# Altium schematic sheet pca10056_sheet6_connectors.SchDoc: PCA10056 - Connectors
size A3; Revision: 0.9.0; SheetNumber: 6; SheetTotal: 7; Author: RUBR; DrawnBy: RUBR; ProjectNumber: 4440; PCAName: PCA10056; PCBRevision: 0240RUBR; DocumentSize: A3; PCBNumber: 400236; ProjectName: nRF52840-DK
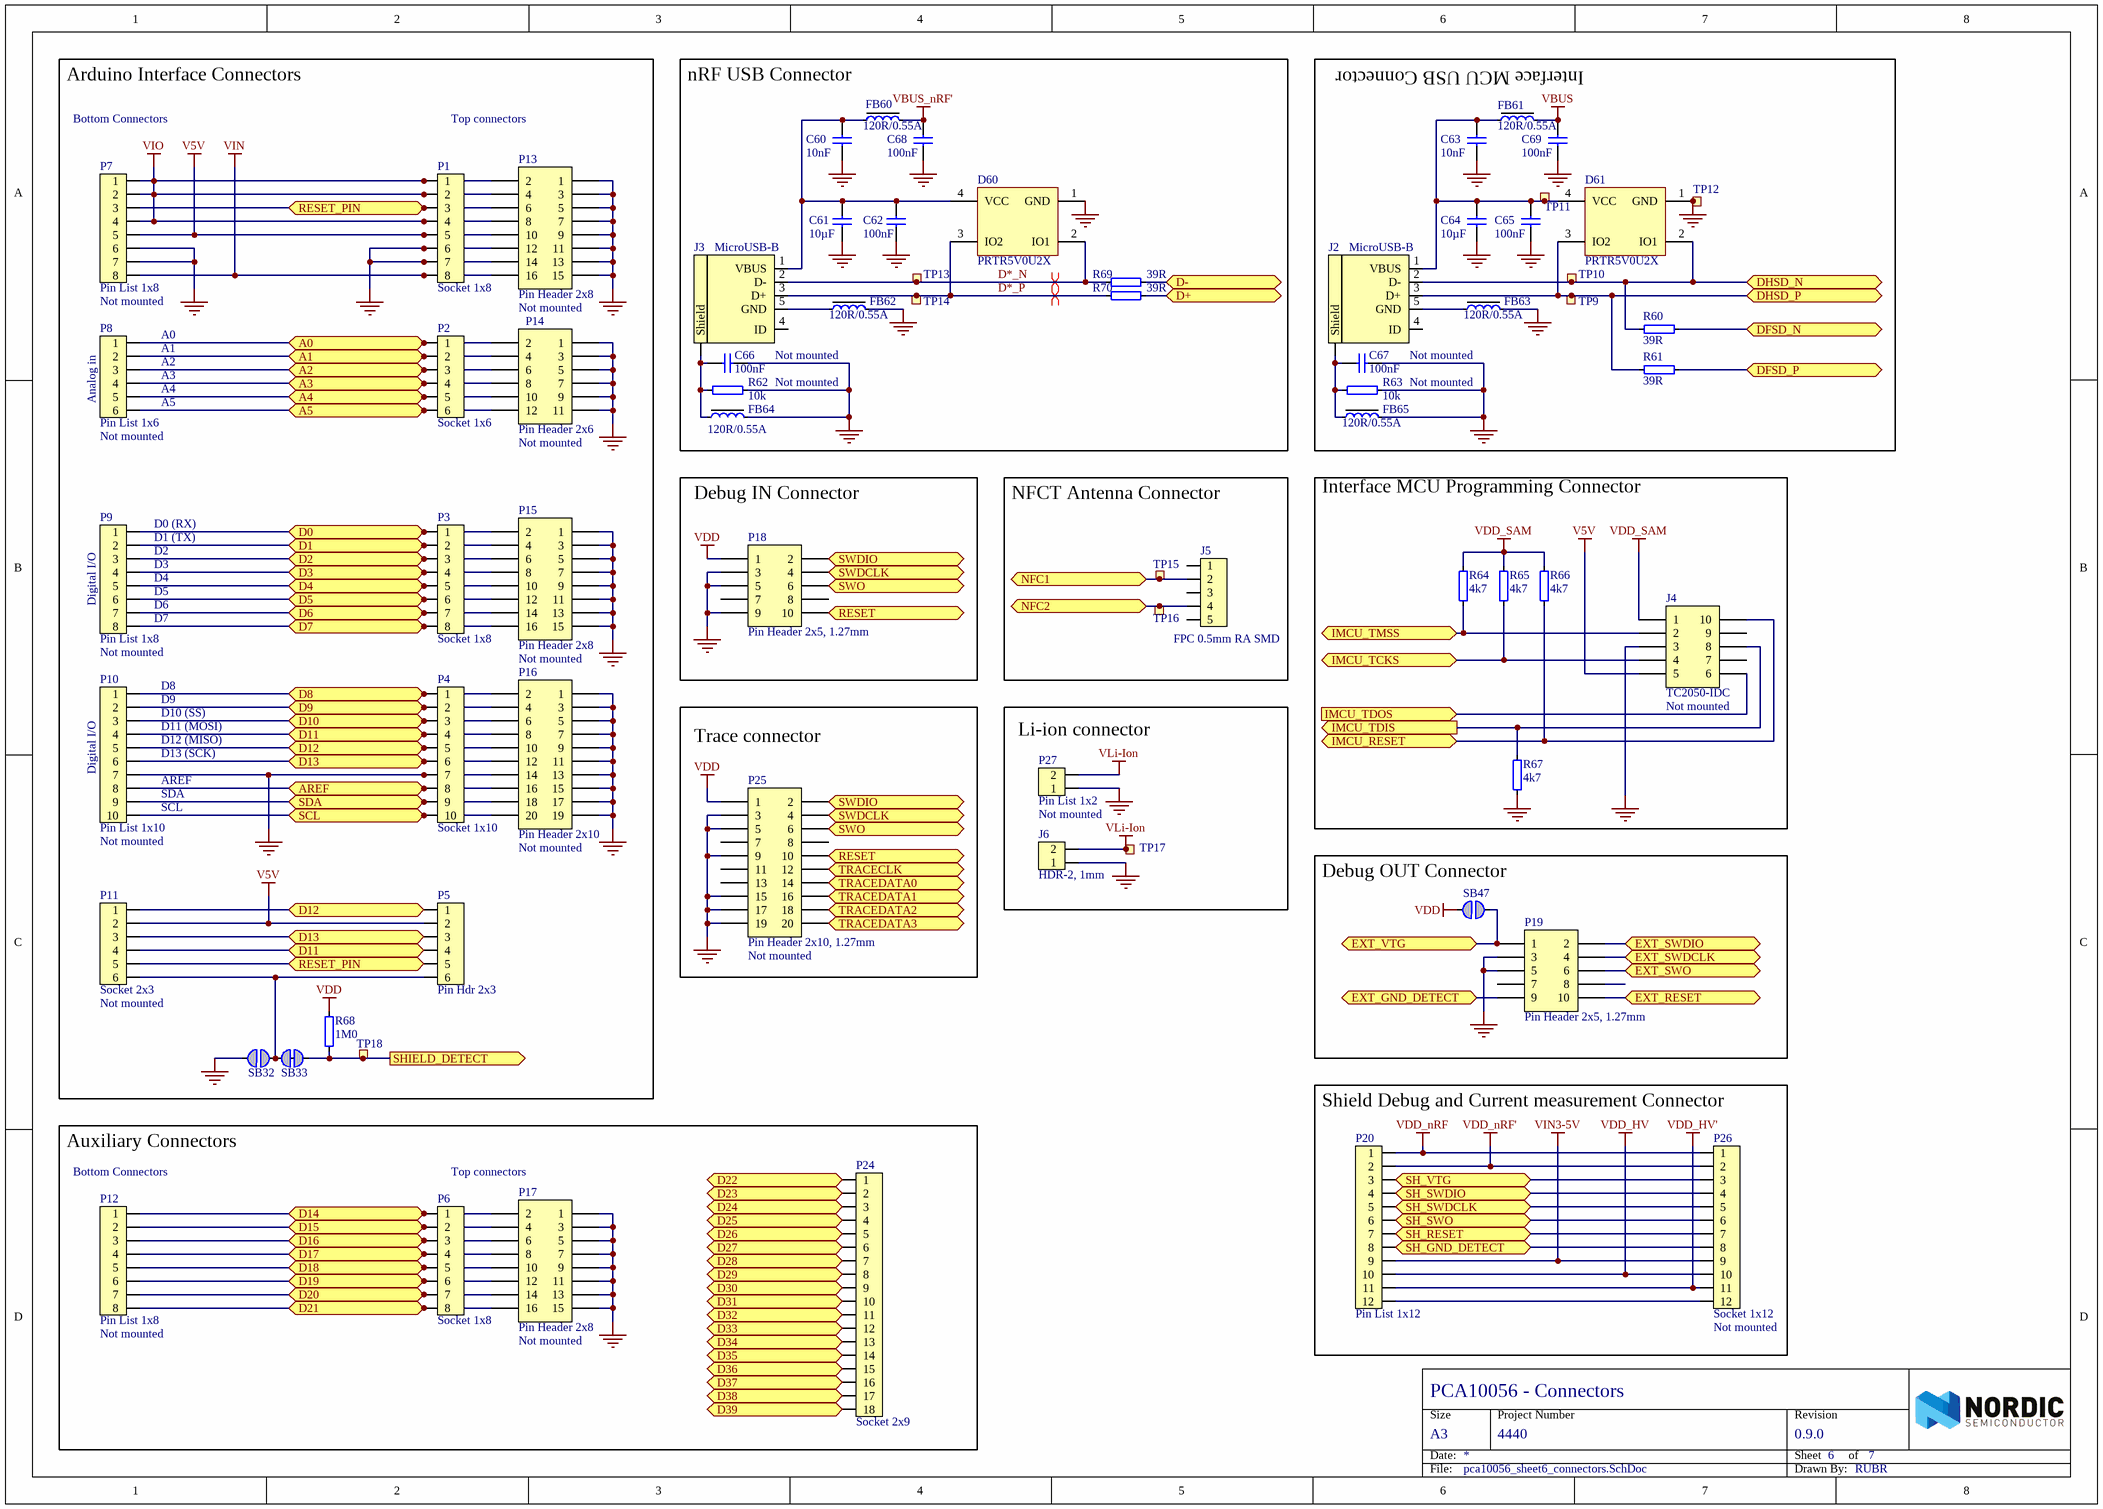
[diagram p0: pca10056_sheet6_connectors.SchDoc]

## Parts
C60  10nF  [CAPC1005X04L]
C61  10µF  [CAPC1608X06L]
C62  100nF  [CAPC1005X04L]
C63  10nF  [CAPC1005X04L]
C64  10µF  [CAPC1608X06L]
C65  100nF  [CAPC1005X04L]
C66  100nF  Assembly: Not mounted  [CAPC1005X04L]
C67  100nF  Assembly: Not mounted  [CAPC1005X04L]
C68  100nF  [CAPC1005X04L]
C69  100nF  [CAPC1005X04L]
D60  PRTR5V0U2X  [SOT190P230X110-4L]
D61  PRTR5V0U2X  [SOT190P230X110-4L]
FB60  120R/0.55A  [INDC1005X04L]
FB61  120R/0.55A  [INDC1005X04L]
FB62  120R/0.55A  [INDC1005X04L]
FB63  120R/0.55A  [INDC1005X04L]
FB64  120R/0.55A  [INDC1005X04L]
FB65  120R/0.55A  [INDC1005X04L]
J2  MicroUSB-B  [USB-Micro-B-RA-SMD-PiP]
J3  MicroUSB-B  [USB-Micro-B-RA-SMD-PiP]
J4  TC2050-IDC  Assembly: Not mounted  [TC2050-IDC-NLFP]
J5  FPC 0.5mm RA SMD  [FPC_05P-0.5mm-RA-SMD]
J6  HDR-2, 1mm  [SM02B-SRSS-TB]
P1  Socket 1x8  [SOCKET_1x8_SMD]
P2  Socket 1x6  [SOCKET_1x6_SMD]
P3  Socket 1x8  [SOCKET_1x8_SMD]
P4  Socket 1x10  [SOCKET_1x10_SMD]
P5  Pin Hdr 2x3  [HDR_2x3-SMD]
P6  Socket 1x8  [SOCKET_1x8_SMD]
P7  Pin List 1x8  Assembly: Not mounted  [LIST_1x8_SMD]
P8  Pin List 1x6  Assembly: Not mounted  [LIST_1x6_SMD]
P9  Pin List 1x8  Assembly: Not mounted  [LIST_1x8_SMD]
P10  Pin List 1x10  Assembly: Not mounted  [LIST_1x10_SMD]
P11  Socket 2x3  Assembly: Not mounted  [SOCKET_2x3_SMD-2.54mm-bottom]
P12  Pin List 1x8  Assembly: Not mounted  [LIST_1x8_SMD]
P13  Pin Header 2x8  Assembly: Not mounted  [HDR_2x8]
P14  Pin Header 2x6  Assembly: Not mounted  [HDR_2x6]
P15  Pin Header 2x8  Assembly: Not mounted  [HDR_2x8]
P16  Pin Header 2x10  Assembly: Not mounted  [HDR_2x10]
P17  Pin Header 2x8  Assembly: Not mounted  [HDR_2x8]
P18  Pin Header 2x5, 1.27mm  [HDR_2x5-SMD-1.27mm-K]
P19  Pin Header 2x5, 1.27mm  [HDR_2x5-SMD-1.27mm-K]
P20  Pin List 1x12  [LIST_1x12_SMD]
P24  Socket 2x9  [SOCKET_2x9_SMD-2.54mm]
P25  Pin Header 2x10, 1.27mm  Assembly: Not mounted  [HDR_2x10-SMD-1.27mm-K]
P26  Socket 1x12  Assembly: Not mounted  [SOCKET_1x12_SMD]
P27  Pin List 1x2  Assembly: Not mounted  [LIST_1x2]
R60  39R  [RESC1005X04L]
R61  39R  [RESC1005X04L]
R62  10k  Assembly: Not mounted  [RESC1005X04L]
R63  10k  Assembly: Not mounted  [RESC1005X04L]
R64  4k7  [RESC1005X04L]
R65  4k7  [RESC1005X04L]
R66  4k7  [RESC1005X04L]
R67  4k7  [RESC1005X04L]
R68  1M0  [RESC1005X04L]
R69  39R  [RESC1005X04L]
R70  39R  [RESC1005X04L]
SB32  Solderbridge  [Solderbridge]  (value not drawn)  (no BOM)
SB33  Solderbridge  [Solderbridge_Shorted]  (value not drawn)  (net tie, no BOM)
SB47  Solderbridge  [Solderbridge]  (value not drawn)  (no BOM)
TP9  Ø1.0mm,SMD  [TP_SMD_Ø1.0mm]  (value not drawn)  (no BOM)
TP10  Ø1.0mm,SMD  [TP_SMD_Ø1.0mm]  (value not drawn)  (no BOM)
TP11  Ø1.0mm,SMD  [TP_SMD_Ø1.0mm]  (value not drawn)  (no BOM)
TP12  Ø1.0mm,SMD  [TP_SMD_Ø1.0mm]  (value not drawn)  (no BOM)
TP13  Ø1.0mm,SMD  [TP_SMD_Ø1.0mm]  (value not drawn)  (no BOM)
TP14  Ø1.0mm,SMD  [TP_SMD_Ø1.0mm]  (value not drawn)  (no BOM)
TP15  Ø1.0mm,SMD  [TP_SMD_Ø1.0mm]  (value not drawn)  (no BOM)
TP16  Ø1.0mm,SMD  [TP_SMD_Ø1.0mm]  (value not drawn)  (no BOM)
TP17  Ø1.0mm,SMD  [TP_SMD_Ø1.0mm]  (value not drawn)  (no BOM)
TP18  Ø1.0mm,SMD  [TP_SMD_Ø1.0mm]  (value not drawn)  (no BOM)

## Blocks framed on the sheet
Arduino Interface Connectors: P1-P5 P7-P11 P13-P16 R68 SB32 SB33 TP18
nRF USB Connector: C60-C62 C66 C68 D60 FB60 FB62 FB64 J3 R62 R69 R70 TP13 TP14
Interface MCU USB Connector: C63-C65 C67 C69 D61 FB61 FB63 FB65 J2 R60 R61 R63 TP9-TP12
Debug IN Connector: P18
NFCT Antenna Connector: J5 TP15 TP16
Interface MCU Programming Connector: J4 R64-R67
Trace connector: P25
Li-ion connector: J6 P27 TP17
Debug OUT Connector: P19 SB47
Shield Debug and Current measurement Connector: P20 P26
Auxiliary Connectors: P6 P12 P17 P24

## Ports
A0 (bidir), A1 (bidir), A2 (bidir), A3 (bidir), A4 (bidir), A5 (bidir), AREF (bidir), D0 (bidir), D1 (bidir), D2 (bidir), D3 (bidir), D4 (bidir), D5 (bidir), D6 (bidir), D7 (bidir), D8 (bidir), D9 (bidir), D10 (bidir), D11 (bidir), D12 (bidir), D13 (bidir), D14 (bidir), D15 (bidir), D16 (bidir), D17 (bidir), D18 (bidir), D19 (bidir), D20 (bidir), D21 (bidir), D22 (bidir), D23 (bidir), D24 (bidir), D25 (bidir), D26 (bidir), D27 (bidir), D28 (bidir), D29 (bidir), D30 (bidir), D31 (bidir), D32 (bidir), D33 (bidir), D34 (bidir), D35 (bidir), D36 (bidir), D37 (bidir), D38 (bidir), D39 (bidir), D+ (bidir), D- (bidir), DFSD_N (bidir), DFSD_P (bidir), DHSD_N (bidir), DHSD_P (bidir), EXT_GND_DETECT (bidir), EXT_RESET (bidir), EXT_SWDCLK (bidir), EXT_SWDIO (bidir), EXT_SWO (bidir), EXT_VTG (bidir), IMCU_RESET (bidir), IMCU_TCKS (bidir), IMCU_TDIS (out), IMCU_TDOS (in), IMCU_TMSS (bidir), NFC1 (bidir), NFC2 (bidir), RESET (bidir), RESET_PIN (bidir), SCL (bidir), SDA (bidir), SH_GND_DETECT (bidir), SH_RESET (bidir), SH_SWDCLK (bidir), SH_SWDIO (bidir), SH_SWO (bidir), SH_VTG (bidir), SHIELD_DETECT (out), SWDCLK (out), SWDIO (bidir), SWO (bidir), TRACECLK (bidir), TRACEDATA0 (bidir), TRACEDATA1 (bidir), TRACEDATA2 (bidir), TRACEDATA3 (bidir)

## Nets
GND: C60.1 C61.1 C62.1 C63.2 C64.1 C65.1 C66.1 C67.1 C68.1 C69.1 D60.1(GND) D61.1(GND) FB62.2 FB63.2 FB64.2 FB65.2 J4.3 J6.1 P1.6 P1.7 P4.7 P7.6 P7.7 P10.7 P13.1 P13.3 P13.5 P13.7 P13.9 P13.11 P13.12 P13.13 P13.14 P13.15 P14.1 P14.3 P14.5 P14.7 P14.9 P14.11 P15.1 P15.3 P15.5 P15.7 P15.9 P15.11 P15.13 P15.15 P16.1 P16.3 P16.5 P16.7 P16.9 P16.11 P16.13 P16.14 P16.15 P16.17 P16.19 P17.1 P17.3 P17.5 P17.7 P17.9 P17.11 P17.13 P17.15 P18.3 P18.5 P18.9 P19.3 P19.5 P25.3 P25.5 P25.9 P25.15 P25.17 P25.19 P27.1 R62.1 R63.1 R67.2 SB32.1 TP12.1
V5V: J4.5 P1.5 P5.2 P7.5 P11.2 P13.10
VBUS: C69.2 FB61.2
VBUS_nRF': C68.2 FB60.2
VDD: P18.1 P25.1 R68.2 SB47.1
VDD_HV: P20.10 P26.10
VDD_HV': P20.11 P26.11
VDD_nRF: P20.1 P26.1
VDD_nRF': P20.2 P26.2
VDD_SAM: J4.1 R64.2 R65.2 R66.2
VIN: P1.8 P7.8 P13.16
VIN3-5V: P20.9 P26.9
VIO: P1.1 P1.2 P1.4 P7.1 P7.2 P7.4 P13.2 P13.4 P13.8
VLi-Ion: J6.2 P27.2 TP17.1
A0: P2.1 P8.1 P14.2 ; port A0
A1: P2.2 P8.2 P14.4 ; port A1
A2: P2.3 P8.3 P14.6 ; port A2
A3: P2.4 P8.4 P14.8 ; port A3
A4: P2.5 P8.5 P14.10 ; port A4
A5: P2.6 P8.6 P14.12 ; port A5
AREF: P4.8 P10.8 P16.16 ; port AREF
D0: P3.1 P9.1 P15.2 ; port D0
D1: P3.2 P9.2 P15.4 ; port D1
D2: P3.3 P9.3 P15.6 ; port D2
D3: P3.4 P9.4 P15.8 ; port D3
D4: P3.5 P9.5 P15.10 ; port D4
D5: P3.6 P9.6 P15.12 ; port D5
D6: P3.7 P9.7 P15.14 ; port D6
D7: P3.8 P9.8 P15.16 ; port D7
D8: P4.1 P10.1 P16.2 ; port D8
D9: P4.2 P10.2 P16.4 ; port D9
D10: P4.3 P10.3 P16.6 ; port D10
D11: P4.4 P5.4 P10.4 P11.4 P16.8 ; port D11
D12: P4.5 P5.1 P10.5 P11.1 P16.10 ; port D12
D13: P4.6 P5.3 P10.6 P11.3 P16.12 ; port D13
D14: P6.1 P12.1 P17.2 ; port D14
D15: P6.2 P12.2 P17.4 ; port D15
D16: P6.3 P12.3 P17.6 ; port D16
D17: P6.4 P12.4 P17.8 ; port D17
D18: P6.5 P12.5 P17.10 ; port D18
D19: P6.6 P12.6 P17.12 ; port D19
D20: P6.7 P12.7 P17.14 ; port D20
D21: P6.8 P12.8 P17.16 ; port D21
D22: P24.1 ; port D22
D23: P24.2 ; port D23
D24: P24.3 ; port D24
D25: P24.4 ; port D25
D26: P24.5 ; port D26
D27: P24.6 ; port D27
D28: P24.7 ; port D28
D29: P24.8 ; port D29
D30: P24.9 ; port D30
D31: P24.10 ; port D31
D32: P24.11 ; port D32
D33: P24.12 ; port D33
D34: P24.13 ; port D34
D35: P24.14 ; port D35
D36: P24.15 ; port D36
D37: P24.16 ; port D37
D38: P24.17 ; port D38
D39: P24.18 ; port D39
D*_N: D60.2(IO1) J3.2(D-) R69.2 TP13.1
D*_P: D60.3(IO2) J3.3(D+) R70.2 TP14.1
D+: R70.1 ; port D+
D-: R69.1 ; port D-
DFSD_N: R60.1 ; port DFSD_N
DFSD_P: R61.1 ; port DFSD_P
DHSD_N: D61.2(IO1) J2.2(D-) R60.2 TP10.1 ; port DHSD_N
DHSD_P: D61.3(IO2) J2.3(D+) R61.2 TP9.1 ; port DHSD_P
EXT_GND_DETECT: P19.9 ; port EXT_GND_DETECT
EXT_RESET: P19.10 ; port EXT_RESET
EXT_SWDCLK: P19.4 ; port EXT_SWDCLK
EXT_SWDIO: P19.2 ; port EXT_SWDIO
EXT_SWO: P19.6 ; port EXT_SWO
EXT_VTG: P19.1 SB47.2 ; port EXT_VTG
IMCU_RESET: J4.10 R66.1 ; port IMCU_RESET
IMCU_TCKS: J4.4 R65.1 ; port IMCU_TCKS
IMCU_TDIS: J4.8 R67.1 ; port IMCU_TDIS
IMCU_TDOS: J4.6 ; port IMCU_TDOS
IMCU_TMSS: J4.2 R64.1 ; port IMCU_TMSS
NFC1: J5.2 TP15.1 ; port NFC1
NFC2: J5.4 TP16.1 ; port NFC2
RESET: P18.10 P25.10 ; port RESET
RESET_PIN: P1.3 P5.5 P7.3 P11.5 P13.6 ; port RESET_PIN
SCL: P4.10 P10.10 P16.20 ; port SCL
SDA: P4.9 P10.9 P16.18 ; port SDA
SH_GND_DETECT: P20.8 P26.8 ; port SH_GND_DETECT
SH_RESET: P20.7 P26.7 ; port SH_RESET
SH_SWDCLK: P20.5 P26.5 ; port SH_SWDCLK
SH_SWDIO: P20.4 P26.4 ; port SH_SWDIO
SH_SWO: P20.6 P26.6 ; port SH_SWO
SH_VTG: P20.3 P26.3 ; port SH_VTG
SHIELD_DETECT: R68.1 SB33.2 TP18.1 ; port SHIELD_DETECT
SWDCLK: P18.4 P25.4 ; port SWDCLK
SWDIO: P18.2 P25.2 ; port SWDIO
SWO: P18.6 P25.6 ; port SWO
TRACECLK: P25.12 ; port TRACECLK
TRACEDATA0: P25.14 ; port TRACEDATA0
TRACEDATA1: P25.16 ; port TRACEDATA1
TRACEDATA2: P25.18 ; port TRACEDATA2
TRACEDATA3: P25.20 ; port TRACEDATA3
NetC60_2: C60.2 C61.2 C62.2 D60.4(VCC) FB60.1 J3.1(VBUS)
NetC63_1: C63.1 C64.2 C65.2 D61.4(VCC) FB61.1 J2.1(VBUS) TP11.1
NetC66_2: C66.2 FB64.1 J3.6(Shield) R62.2
NetC67_2: C67.2 FB65.1 J2.6(Shield) R63.2
NetFB62_1: FB62.1 J3.5(GND)
NetFB63_1: FB63.1 J2.5(GND)
NetP5_6: P5.6 P11.6 SB32.2 SB33.1
NetP20_12: P20.12 P26.12

Not connected (* = marked no-connect by the designer): J2 4(ID); J3 4(ID); J4 7 9; J5 1 3 5; P18 7 8; P19 7 8; P25 7 8 11 13

## Layout directives
differential pair: D*_N, D*_P

## Notes on the sheet
- Bottom Connectors
- Top connectors
- (near P8) A0
- (near P8) A1
- (near P8) A2
- (near P8) A3
- (near P8) Analog in
- (near P8) A4
- (near P8) A5
- (near P9) D0 (RX)
- (near P9) D1 (TX)
- (near P9) D2
- (near P9) D3
- (near P9) D4
- (near P9) Digital I/O
- (near P9) D5
- (near P9) D6
- (near P9) D7
- (near P10) D8
- (near P10) D9
- (near P10) D10 (SS)
- (near P10) Digital I/O
- (near P10) AREF
- (near P10) D11 (MOSI)
- (near P10) D12 (MISO)
- (near P10) D13 (SCK)
- (near P10) SDA
- (near P10) SCL
- (near P12) Bottom Connectors
- Size
- Date:
- Project Number
- Sheet         of
- Revision
- File:
- Drawn By:

## Library data of the parts
C60 C63 = C0402-10n: Capacitor, X7R, ±10%; Part number IPS: 00000002386; Note: 16V; Artikkelnr Noca: 20039166; Artikkelnr Simpro: N.A.; Part Number: C0402-10n; Manufacturer: *; Manufacturer Part Number: *; Datasheet: *; LatestRevisionDate: 2009-11-23; Pin Count: 2; Publisher: Nordic Semiconductor; Published: 2009-05-08; Value: 10nF; Supplier: *; Supplier part number: *; 2nd source Supplier: *; 2nd source part number: *; Footprint Doc: 0402
C61 C64 = C0603-10µ: Capacitor, X5R, ±20%; Part number IPS: 00000003029; Note: 6.3V; Artikkelnr Noca: 20039234; Artikkelnr Simpro: N.A.; Part Number: C0603-10µ; Manufacturer: *; Manufacturer Part Number: *; Datasheet: *; LatestRevisionDate: 2011-01-17; Pin Count: 2; Publisher: Nordic Semiconductor; Published: 2011-01-17; Value: 10µF; Supplier: *; Supplier part number: *; 2nd source Supplier: *; 2nd source part number: *; Footprint Doc: 0603
C62 C65-C69 = C0402-100n: Capacitor, X7R, ±10%; Part number IPS: 00000005296; Note: 16V; Artikkelnr Noca: 20039200; Artikkelnr Simpro: N.A.; Part Number: C0402-100n; Manufacturer: *; Manufacturer Part Number: *; Datasheet: *; LatestRevisionDate: 2009-11-23; Pin Count: 2; Publisher: Nordic Semiconductor; Published: 2009-05-08; Value: 100nF; Supplier: *; Supplier part number: *; 2nd source Supplier: *; 2nd source part number: *; Footprint Doc: 0402
D60 D61 = PRTR5V0U2X: Ultra low capacitance double rail-to-rail ESD protection diode; Manufacturer: NXP; 2nd source part number: 152-4157; Artikkelnr Noca: 10069015; Artikkelnr Simpro: N.A.; Part Number: PRTR5V0U2X; Manufacturer Part Number: PRTR5V0U2X; Datasheet: http://www.farnell.com/datasheets/109718.pdf; LatestRevisionDate: 2012-06-11; Publisher: Nordic Semiconductor; Published: 2012-06-11; Value: PRTR5V0U2X; Note: *; Supplier: Digi-Key; Supplier part number: 568-4140-1-ND; 2nd source Supplier: Farnell; Footprint Doc: SOT-143B
FB60-FB65 = FB0402-120R@100M-500mA: Ferrite Bead, 120 Ohm @ 100MHz, 500mA, 250 mOhm Max; Manufacturer: Murata; Manufacturer Part Number: BLM15AG121SN1D; 2nd source part number: 151-5760; Note: Chip EMIFIL Inductor Type Chip Ferrite Bead; Artikkelnr Noca: 33029317; Artikkelnr Simpro: N.A.; Part Number: FB0402-120R@100M-500mA; Datasheet: http://search.murata.co.jp/Ceramy/image/img/PDF/ENG/L0110S0100BLM15A_SN.pdf; Footprint Doc: 0402; LatestRevisionDate: 2014-01-10; Pin Count: 2; Publisher: Nordic Semiconductor; Published: 2011-11-14; Value: 120R/0.55A; Supplier: Digi-Key; Supplier part number: 490-1005-1-ND; 2nd source Supplier: Farnell
J2 J3 = USB-Micro-B-RA-SMD-PiP: MicroUSB-B-SMT; Manufacturer: Allen Creations Corp.; Manufacturer Part Number: AJU55-BS2111-L; 2nd source part number: 609-4616-1-ND; Artikkelnr Noca: 55029020; Artikkelnr Simpro: N.A.; Part Number: USB-Micro-B-RA-SMD-PiP; Datasheet: \\hizz\pro\app9717\Datasheet\connectores\Allen Creations Corp\AJU-211.pdf; Footprint Doc: USB-Micro-B-RA-SMD-PiP; LatestRevisionDate: 2016-04-21; Pin Count: 5; Publisher: Nordic Semiconductor; Published: 2014-10-07; Value: MicroUSB-B; Note: *; Supplier: Cabcon; Supplier part number: AJU55-BS2111-L; 2nd source Supplier: Digi-Key
J4 = TC2050-IDC-NLFP: CBL PLUG-OF-NAILS 10-PIN; Manufacturer: Tag-Connect LLC; Artikkelnr Noca: N.A.; Part Number: TC2050-IDC-NLFP; Manufacturer Part Number: TC2050-IDC-NLFP; Datasheet: http://www.tag-connect.com/Materials/TC2050-IDC%20Datasheet.pdf; LatestRevisionDate: 2012-11-21; Publisher: Nordic Semiconductor; Published: 2012-11-21; Value: TC2050-IDC; Supplier: Digi-Key; Supplier part number: TC2050-IDC-NL-ND; 2nd source Supplier: *; 2nd source part number: *; Pin Count: 10; Footprint Doc: TC2050-IDC-NLFP; Artikkelnr Simpro: N.A.
J5 = FPC_05P-0.5mm-RA-SMD: 0.5mm FPC, 5P,Right Angle SMT,Double Contact,H=1.2mm,White, Tin plated; Manufacturer: W-CON; Manufacturer Part Number: 5141-05RZDNWR01; 2nd source part number: WM9836CT-ND; Artikkelnr Noca: 55010020; Artikkelnr Simpro: N.A.; Part Number: FPC_05P-0.5mm-RA-SMD; Datasheet: \\hizz\pro\app9717\Datasheet\connectores\W-CON\5141-XXRZDNXX0X.pdf; Footprint Doc: FPC_05P-0.5mm-RA-SMD; LatestRevisionDate: 2016-04-21; Pin Count: 7; Publisher: Nordic Semiconductor; Published: 2015-06-22; Value: FPC 0.5mm RA SMD; Note: *; Supplier: Cabcon; Supplier part number: 5141-05RZDNWR01; 2nd source Supplier: Digi-Key
J6 = SM02B-SRSS-TB: 1.0mm pitch connector side entry SMD; Manufacturer: JST; Manufacturer Part Number: SM02B-SRSS-TB(LF)(SN); Note: JST, Header; Artikkelnr Noca: 55010030; Artikkelnr Simpro: N.A.; Part Number: SM02B-SRSS-TB; Datasheet: http://www.jst-mfg.com/product/pdf/eng/eSH.pdf; Footprint Doc: SM02B-SRSS-TB; LatestRevisionDate: 2016-06-20; Pin Count: 2; Publisher: Nordic Semiconductor; Published: 2016-06-20; Value: HDR-2, 1mm; Supplier: Digi-Key; Supplier part number: 455-1802-1-ND; 2nd source Supplier: *; 2nd source part number: *
P1 P3 P6 = Socket 1x8 SMD: Socket 1x8, 2.54mm (100mil), SMD; Manufacturer: W-CON; Manufacturer Part Number: 2171-108MS0CUNR1; 2nd source part number: SSM-108-F-SV-P-TR; Artikkelnr Noca: 55030002; Artikkelnr Simpro: N.A.; Part Number: Socket 1x8 SMD; Datasheet: *; Footprint Doc: SOCKET_1x8_SMD; LatestRevisionDate: 2016-01-22; Pin Count: 8; Publisher: Nordic Semiconductor; Published: 2016-01-22; Value: Socket 1x8; Note: *; Supplier: Cabcon; Supplier part number: 2171-108MS0CUNR1; 2nd source Supplier: Samtec
P2 = Socket 1x6 SMD: Socket 1x6, 2.54mm (100mil), SMD; Manufacturer: W-CON; Manufacturer Part Number: 2171-106MS0CUNR1; 2nd source part number: SSM-106-F-SV-P-TR; Artikkelnr Noca: 55030001; Artikkelnr Simpro: N.A.; Part Number: Socket 1x6 SMD; Datasheet: *; Footprint Doc: SOCKET_1x6_SMD; LatestRevisionDate: 2016-01-22; Pin Count: 6; Publisher: Nordic Semiconductor; Published: 2016-01-22; Value: Socket 1x6; Note: *; Supplier: Cabcon; Supplier part number: 2171-106MS0CUNR1; 2nd source Supplier: Samtec
P4 = Socket 1x10 SMD: Socket 1x10, 2.54mm (100mil), SMD; Manufacturer: W-CON; Manufacturer Part Number: 2171-110MS0CUNR1; 2nd source part number: SSM-110-F-SV-P-TR; Artikkelnr Noca: 55030004; Artikkelnr Simpro: N.A.; Part Number: Socket 1x10 SMD; Datasheet: *; Footprint Doc: SOCKET_1x10_SMD; LatestRevisionDate: 2016-01-22; Pin Count: 10; Publisher: Nordic Semiconductor; Published: 2016-01-22; Value: Socket 1x10; Note: *; Supplier: Cabcon; Supplier part number: 2171-110MS0CUNR1; 2nd source Supplier: Samtec
P5 = Pin Header 2x3 SMD: Pin Header 2x3, 2.54mm (100mil) SMD; Manufacturer: W-CON; Manufacturer Part Number: 1125-1203S0M116R1; 2nd source part number: TSM-103-01-L-DV; Artikkelnr Noca: 55010007; Artikkelnr Simpro: N.A.; Part Number: Pin Header 2x3 SMD; Datasheet: \\hizz\pro\app9717\Datasheet\connectores\W-CON\1125-12XXXXMXXXXX.PDF; Footprint Doc: HDR_2x3-SMD; LatestRevisionDate: 2016-01-22; Pin Count: 6; Publisher: Nordic Semiconductor; Published: 2016-01-22; Value: Pin Hdr 2x3; Note: SMD; Supplier: Cabcon; Supplier part number: 1125-1203S0M116R1; 2nd source Supplier: Samtec
P7 P9 P12 = Pin List 1x8 SMD: Pin List 1x8, 2.54mm (100mil), SMD; Manufacturer: W-CON; Manufacturer Part Number: 1125-1108S0M116R2; 2nd source part number: TSM-108-01-L-SV-P-TR; Artikkelnr Noca: 55010006; Artikkelnr Simpro: N.A.; Part Number: Pin List 1x8 SMD; Datasheet: \\hizz\pro\app9717\Datasheet\connectores\W-CON\1125-11XXXXMXXXXX.pdf; LatestRevisionDate: 2016-01-22; Publisher: Nordic Semiconductor; Published: 2016-01-22; Value: Pin List 1x8; Note: *; Supplier: Cabcon; Supplier part number: 1125-1108S0M116R2; 2nd source Supplier: Samtec; Pin Count: 8; Footprint Doc: LIST_1x8_SMD
P8 = Pin List 1x6 SMD: Pin List 1x6, 2.54mm (100mil), SMD; Manufacturer: W-CON; Manufacturer Part Number: 1125-1106S0M116R2; 2nd source part number: TSM-106-01-L-SV-P-TR; Artikkelnr Noca: 55010026; Artikkelnr Simpro: N.A.; Part Number: Pin List 1x6 SMD; Datasheet: \\hizz\pro\app9717\Datasheet\connectores\W-CON\1125-11XXXXMXXXXX.pdf; LatestRevisionDate: 2016-03-29; Pin Count: 6; Publisher: Nordic Semiconductor; Published: 2016-03-29; Value: Pin List 1x6; Note: *; Supplier: Cabcon; Supplier part number: 1125-1106S0M116R2; 2nd source Supplier: Samtec; Footprint Doc: LIST_1x6_SMD
P10 = Pin List 1x10 SMD: Pin List 1x10, 2.54mm (100mil), SMD; Manufacturer: W-CON; Manufacturer Part Number: 1125-1110S0M116R2; 2nd source part number: TSM-110-01-L-SV-P-TR; Artikkelnr Noca: 55010028; Artikkelnr Simpro: N.A.; Part Number: Pin List 1x10 SMD; Datasheet: \\hizz\pro\app9717\Datasheet\connectores\W-CON\1125-11XXXXMXXXXX.pdf; LatestRevisionDate: 2016-03-29; Publisher: Nordic Semiconductor; Published: 2016-03-29; Value: Pin List 1x10; Note: *; Supplier: Cabcon; Supplier part number: 1125-1110S0M116R2; 2nd source Supplier: Samtec; Pin Count: 10; Footprint Doc: LIST_1x10_SMD
P11 = Socket 2x3 SMD Bottom: Socket 2x3, 2.54mm (100mil), SMD; Manufacturer: W-CON; Manufacturer Part Number: 2171-203MS0CUNR1; 2nd source part number: SSM-103-F-DV-P-TR; Artikkelnr Noca: 55030010; Artikkelnr Simpro: N.A.; Part Number: Socket 2x3 SMD Bottom; Datasheet: \\hizz\pro\app9717\Datasheet\connectores\W-CON\2171-2XXMXXCUNXX.pdf; LatestRevisionDate: 2016-03-29; Pin Count: 6; Publisher: Nordic Semiconductor; Published: 2014-06-10; Value: Socket 2x3; Note: *; Supplier: Cabcon; Supplier part number: 2171-203MS0CUNR1; 2nd source Supplier: Samtec; Footprint Doc: SOCKET_2x3_SMD-2.54mm-bottom
P13 P15 P17 = Pin Header 2x8: Pin Header 2x8, 2.54mm (100mil); Artikkelnr Noca: N.A.; Part Number: Pin Header 2x8; Manufacturer: *; Manufacturer Part Number: *; Datasheet: *; Footprint Doc: HDR_2x8; LatestRevisionDate: 2009-12-12; Pin Count: 16; Publisher: Nordic Semiconductor; Published: 2009-12-12; Value: Pin Header 2x8; Note: *; Supplier: *; Supplier part number: *; 2nd source Supplier: *; 2nd source part number: *; Artikkelnr Simpro: N.A.
P14 = Pin Header 2x6: Pin Header 2x6, 2.54mm (100mil); Artikkelnr Noca: N.A.; Part Number: Pin Header 2x6; Manufacturer: *; Manufacturer Part Number: *; Datasheet: *; Footprint Doc: HDR_2x6; LatestRevisionDate: 2014-07-04; Pin Count: 12; Publisher: Nordic Semiconductor; Published: 2009-12-12; Value: Pin Header 2x6; Note: *; Supplier: *; Supplier part number: *; 2nd source Supplier: *; 2nd source part number: *; Artikkelnr Simpro: N.A.
P16 = Pin Header 2x10: Pin Header 2x10, 2.54mm (100mil); Artikkelnr Noca: N.A.; Part Number: Pin Header 2x10; Manufacturer: *; Manufacturer Part Number: *; Datasheet: *; Footprint Doc: HDR_2x10; LatestRevisionDate: 2014-07-04; Pin Count: 20; Publisher: Nordic Semiconductor; Published: 2009-12-12; Value: Pin Header 2x10; Note: *; Supplier: *; Supplier part number: *; 2nd source Supplier: *; 2nd source part number: *; Artikkelnr Simpro: N.A.
P18 P19 = Pin Header 2x5 SMD, 1.27mm, KS: Pin Header 2x5, 1.27mm (50mil), SMD, Keying Shroud; Manufacturer: W-CON; Manufacturer Part Number: 3132-10MS0BK00R1; 2nd source part number: FTSH-105-01-F-DV-K; Artikkelnr Noca: 55010009; Artikkelnr Simpro: N.A.; Part Number: Pin Header 2x5 SMD, 1.27mm, KS; Datasheet: \\hizz\pro\app9717\Datasheet\connectores\W-CON\3132-XXMXXBK00XX.pdf; Footprint Doc: HDR_2x5-SMD-1.27mm; LatestRevisionDate: 2016-04-21; Pin Count: 10; Publisher: Nordic Semiconductor; Published: 2016-01-22; Value: Pin Header 2x5, 1.27mm; Note: *; Supplier: Cabcon; Supplier part number: 3132-10MS0BK00R1; 2nd source Supplier: Samtec
P20 = Pin List 1x12 SMD: Pin List 1x12, 2.54mm (100mil), SMD; Artikkelnr Noca: 55019293; Artikkelnr Simpro: N.A.; Part Number: Pin List 1x12 SMD; Manufacturer: *; Manufacturer Part Number: *; Datasheet: *; Footprint Doc: LIST_1x12_SMD; LatestRevisionDate: 2015-11-10; Pin Count: 12; Publisher: Nordic Semiconductor; Published: 2015-11-10; Value: Pin List 1x12; Note: *; Supplier: Samtec; Supplier part number: TSM-112-01-L-SV-P-TR; 2nd source Supplier: *; 2nd source part number: *
P24 = Socket 2x9 SMD: Socket 2x9, 2.54mm (100mil), SMD; Manufacturer: Samtec; Manufacturer Part Number: SSM-109-F-DV; Artikkelnr Noca: 55030011; Artikkelnr Simpro: N.A.; Part Number: Socket 2x9 SMD; Datasheet: http://suddendocs.samtec.com/prints/ssm-1xx-xxx-dv-xx-xx-xxx-xx-mkt.pdf; Footprint Doc: SOCKET_2x9_SMD-2.54mm; LatestRevisionDate: 2016-07-07; Pin Count: 18; Publisher: Nordic Semiconductor; Published: 2016-07-07; Value: Socket 2x9; Note: *; Supplier: Samtec; Supplier part number: SSM-109-F-DV-P-TR
P25 = Pin Header 2x10 SMD, 1.27mm, KS: Pin Header 2x10, 1.27mm (50mil), SMD, Keying Shroud; Manufacturer: Samtec; Manufacturer Part Number: FTSH-110-01-F-DV-K; Artikkelnr Noca: N.A.; Part Number: Pin Header 2x10 SMD, 1.27mm, KS; Datasheet: http://www.digikey.com/product-search/en?vendor=0&keywords=FTSH-110-01-F-DV-K; LatestRevisionDate: 2016-04-21; Pin Count: 20; Publisher: Nordic Semiconductor; Published: 2014-05-23; Value: Pin Header 2x10, 1.27mm; Note: *; Supplier: Digi-Key; Supplier part number: FTSH-110-01-F-DV-K-ND; 2nd source Supplier: *; 2nd source part number: *; Footprint Doc: HDR_2x10-SMD-1.27mm; Artikkelnr Simpro: N.A.
P26 = Socket 1x12 SMD: Socket 1x12, 2.54mm (100mil), SMD; Manufacturer: Samtec; Manufacturer Part Number: SSM-109-L-SV; Artikkelnr Noca: N.A.; Part Number: Socket 1x12 SMD; Datasheet: *; Footprint Doc: SOCKET_1x12_SMD; LatestRevisionDate: 2016-07-07; Pin Count: 12; Publisher: Nordic Semiconductor; Published: 2016-07-07; Value: Socket 1x12; Note: *; Supplier: *; Supplier part number: *; 2nd source Supplier: Samtec; 2nd source part number: SSM-109-L-SV; Artikkelnr Simpro: N.A.
P27 = Pin List 1x2: Pin List 1x2, 2.54mm (100mil); Artikkelnr Noca: 56019040; Artikkelnr Simpro: N.A.; Part Number: Pin List 1x2; Manufacturer: *; Manufacturer Part Number: *; Datasheet: *; Footprint Doc: LIST_1x2; LatestRevisionDate: 2009-12-12; Pin Count: 2; Publisher: Nordic Semiconductor; Published: 2009-12-12; Value: Pin List 1x2; Note: *; Supplier: *; Supplier part number: *; 2nd source Supplier: *; 2nd source part number: *
R60 R61 R69 R70 = R0402-39R: Resistor, ±1%, 0.063W; Part number IPS: 00000000821; Note: Chip Res 1%; Artikkelnr Noca: 27049039; Artikkelnr Simpro: N.A.; Value Ohm: 39; Value: 39R; Part Number: R0402-39R; Manufacturer: *; Manufacturer Part Number: *; Datasheet: *; LatestRevisionDate: 2009-11-23; Pin Count: 2; Publisher: Nordic Semiconductor; Published: 2009-05-08; Supplier: Farnell; Supplier part number: 173-8831; 2nd source Supplier: *; 2nd source part number: *; Footprint Doc: 0402
R62 R63 = R0402-10k: Resistor, ±1%, 0.063W; Part number IPS: 00000002093; Note: Chip Res 1%; Artikkelnr Noca: 27049097; Artikkelnr Simpro: N.A.; Value Ohm: 10000; Value: 10k; Part Number: R0402-10k; Manufacturer: *; Manufacturer Part Number: *; Datasheet: *; LatestRevisionDate: 2009-11-23; Pin Count: 2; Publisher: Nordic Semiconductor; Published: 2009-05-08; Supplier: Farnell; Supplier part number: 173-8864; 2nd source Supplier: *; 2nd source part number: *; Footprint Doc: 0402
R64-R67 = R0402-4k7: Resistor, ±1%, 0.063W; Part number IPS: 00000003433; Note: Chip Res 1%; Artikkelnr Noca: 27049089; Artikkelnr Simpro: N.A.; Value Ohm: 4700; Part Number: R0402-4k7; Manufacturer: *; Manufacturer Part Number: *; Datasheet: *; LatestRevisionDate: 2009-11-23; Pin Count: 2; Publisher: Nordic Semiconductor; Published: 2009-05-08; Value: 4k7; Supplier: Farnell; Supplier part number: 173-8858; 2nd source Supplier: *; 2nd source part number: *; Footprint Doc: 0402
R68 = R0402-1M0: Resistor, ±1%, 0.063W; Note: Chip Res 1%; Artikkelnr Noca: 27049145; Artikkelnr Simpro: N.A.; Value Ohm: 1000000; Part Number: R0402-1M0; Manufacturer: *; Manufacturer Part Number: *; Datasheet: *; Footprint Doc: 0402; LatestRevisionDate: 2009-11-23; Pin Count: 2; Publisher: Nordic Semiconductor; Published: 2009-05-08; Value: 1M0; Supplier: *; Supplier part number: *; 2nd source Supplier: *; 2nd source part number: *
SB32 SB47 = Solderbridge: Artikkelnr Noca: N.A.; Part Number: Solderbridge; Manufacturer: *; Manufacturer Part Number: *; Datasheet: *; Footprint Doc: Solderbridge; LatestRevisionDate: 2009-12-14; Pin Count: 2; Publisher: Nordic Semiconductor; Published: 2009-12-14; Value: Solderbridge; Note: *; Supplier: *; Supplier part number: *; 2nd source Supplier: *; 2nd source part number: *; Artikkelnr Simpro: N.A.
SB33 = Solderbridge Shorted: Shorted Solderbridge; Artikkelnr Noca: N.A.; Part Number: Solderbridge Shorted; Manufacturer: *; Manufacturer Part Number: *; Datasheet: *; Footprint Doc: Solderbridge_Shorted; LatestRevisionDate: 2012-08-07; Pin Count: 2; Publisher: Nordic Semiconductor; Published: 2012-08-07; Value: Solderbridge; Note: *; Supplier: *; Supplier part number: *; 2nd source Supplier: *; 2nd source part number: *; Artikkelnr Simpro: N.A.
TP9-TP18 = TP_SMD_Ø1.0MM: 1.0mm circular SMD testpad; Manufacturer: Nordic Semiconductor; Artikkelnr Noca: N.A.; Part Number: TP_SMD_Ø1.0MM; Manufacturer Part Number: *; Datasheet: *; LatestRevisionDate: 2013-06-11; Pin Count: 1; Publisher: Nordic Semiconductor; Published: 2013-06-11; Value: Ø1.0mm,SMD; Note: *; Supplier: *; Supplier part number: *; 2nd source Supplier: *; 2nd source part number: *; Footprint Doc: TP_SMD_Ø1.0mm; Artikkelnr Simpro: N.A.